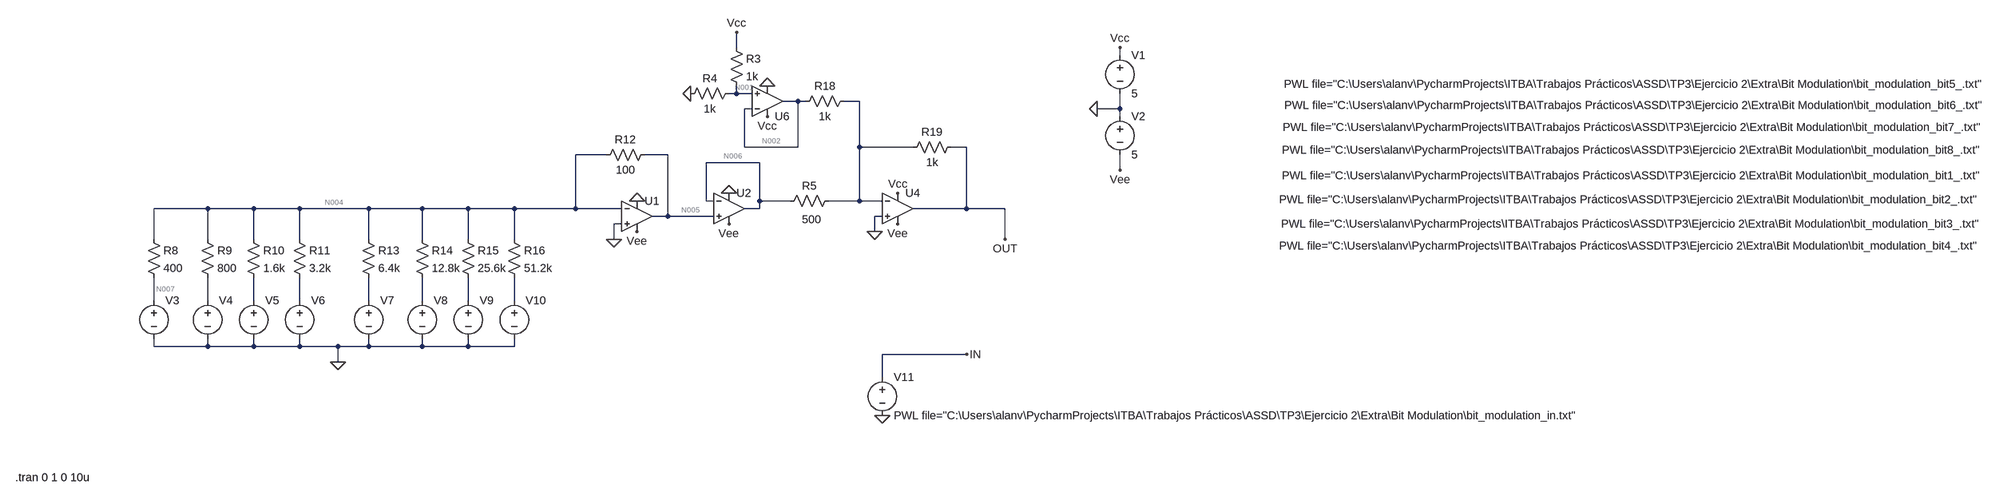
[diagram p0: schematic Bit_Modulation.asc]
Bit_Modulation.asc, the LTspice schematic file:
Version 4
SHEET 1 3244 760
WIRE 432 -160 432 -192
WIRE 1232 -144 1232 -160
WIRE 432 -64 432 -80
WIRE 432 -64 416 -64
WIRE 464 -64 432 -64
WIRE 560 -48 528 -48
WIRE 576 -48 560 -48
WIRE 688 -48 656 -48
WIRE 464 -32 448 -32
WIRE 1232 -32 1232 -64
WIRE 1232 -32 1184 -32
WIRE 1232 -16 1232 -32
WIRE 448 48 448 -32
WIRE 560 48 560 -48
WIRE 560 48 448 48
WIRE 688 48 688 -48
WIRE 800 48 688 48
WIRE 912 48 880 48
WIRE 160 64 96 64
WIRE 288 64 240 64
WIRE 480 80 368 80
WIRE 1232 96 1232 64
WIRE 368 160 368 80
WIRE 384 160 368 160
WIRE 480 160 480 80
WIRE 544 160 480 160
WIRE 688 160 688 48
WIRE 688 160 624 160
WIRE 736 160 688 160
WIRE -672 176 -784 176
WIRE -576 176 -672 176
WIRE -480 176 -576 176
WIRE -336 176 -480 176
WIRE -224 176 -336 176
WIRE -128 176 -224 176
WIRE -32 176 -128 176
WIRE 96 176 96 64
WIRE 96 176 -32 176
WIRE 192 176 96 176
WIRE 480 176 480 160
WIRE 480 176 448 176
WIRE 912 176 912 48
WIRE 912 176 800 176
WIRE 992 176 912 176
WIRE 288 192 288 64
WIRE 288 192 256 192
WIRE 384 192 288 192
WIRE 736 192 720 192
WIRE 192 208 176 208
WIRE 720 224 720 192
WIRE -784 240 -784 176
WIRE -672 240 -672 176
WIRE -576 240 -576 176
WIRE -480 240 -480 176
WIRE -336 240 -336 176
WIRE -224 240 -224 176
WIRE -128 240 -128 176
WIRE -32 240 -32 176
WIRE 176 240 176 208
WIRE 992 240 992 176
WIRE -784 368 -784 320
WIRE -672 368 -672 320
WIRE -576 368 -576 320
WIRE -480 368 -480 320
WIRE -336 368 -336 320
WIRE -224 368 -224 320
WIRE -128 368 -128 320
WIRE -32 368 -32 320
WIRE -784 464 -784 448
WIRE -672 464 -672 448
WIRE -672 464 -784 464
WIRE -576 464 -576 448
WIRE -576 464 -672 464
WIRE -480 464 -480 448
WIRE -480 464 -576 464
WIRE -400 464 -480 464
WIRE -336 464 -336 448
WIRE -336 464 -400 464
WIRE -224 464 -224 448
WIRE -224 464 -336 464
WIRE -128 464 -128 448
WIRE -128 464 -224 464
WIRE -32 464 -32 448
WIRE -32 464 -128 464
WIRE 912 480 736 480
WIRE -400 496 -400 464
WIRE 736 528 736 480
FLAG 1184 -32 0
FLAG 1232 -160 Vcc
FLAG 1232 96 Vee
FLAG 224 224 Vee
FLAG 768 144 Vcc
FLAG 768 208 Vee
FLAG 176 240 0
FLAG 336 -64 0
FLAG 432 -192 Vcc
FLAG 992 240 OUT
FLAG 496 -16 Vcc
FLAG 736 608 0
FLAG 912 480 IN
FLAG 720 224 0
FLAG 416 208 Vee
FLAG 224 160 0
FLAG 416 144 0
FLAG 496 -80 0
FLAG -400 496 0
SYMBOL OpAmps\\UniversalOpamp2 224 192 R0
SYMATTR InstName U1
SYMBOL voltage 1232 -160 R0
WINDOW 123 0 0 Left 0
WINDOW 39 0 0 Left 0
SYMATTR InstName V1
SYMATTR Value 5
SYMBOL voltage 1232 -32 R0
WINDOW 123 0 0 Left 0
WINDOW 39 0 0 Left 0
SYMATTR InstName V2
SYMATTR Value 5
SYMBOL OpAmps\\UniversalOpamp2 768 176 R0
SYMATTR InstName U4
SYMBOL res 416 -176 R0
SYMATTR InstName R3
SYMATTR Value 1k
SYMBOL res 432 -80 R90
WINDOW 0 0 56 VBottom 2
WINDOW 3 32 56 VTop 2
SYMATTR InstName R4
SYMATTR Value 1k
SYMBOL res 640 144 R90
WINDOW 0 0 56 VBottom 2
WINDOW 3 39 51 VTop 2
SYMATTR InstName R5
SYMATTR Value 500
SYMBOL res -800 224 R0
SYMATTR InstName R8
SYMATTR Value 400
SYMBOL res -688 224 R0
SYMATTR InstName R9
SYMATTR Value 800
SYMBOL res -592 224 R0
SYMATTR InstName R10
SYMATTR Value 1.6k
SYMBOL res -496 224 R0
SYMATTR InstName R11
SYMATTR Value 3.2k
SYMBOL voltage -784 352 R0
WINDOW 3 2354 -245 Left 2
WINDOW 123 0 0 Left 0
WINDOW 39 0 0 Left 0
SYMATTR Value PWL file="C:\Users\alanv\PycharmProjects\ITBA\Trabajos Prácticos\ASSD\TP3\Ejercicio 2\Extra\Bit Modulation\bit_modulation_bit1_.txt"
SYMATTR InstName V3
SYMBOL voltage -672 352 R0
WINDOW 3 2236 -195 Left 2
WINDOW 123 0 0 Left 0
WINDOW 39 0 0 Left 0
SYMATTR Value PWL file="C:\Users\alanv\PycharmProjects\ITBA\Trabajos Prácticos\ASSD\TP3\Ejercicio 2\Extra\Bit Modulation\bit_modulation_bit2_.txt"
SYMATTR InstName V4
SYMBOL voltage -576 352 R0
WINDOW 3 2144 -144 Left 2
WINDOW 123 0 0 Left 0
WINDOW 39 0 0 Left 0
SYMATTR Value PWL file="C:\Users\alanv\PycharmProjects\ITBA\Trabajos Prácticos\ASSD\TP3\Ejercicio 2\Extra\Bit Modulation\bit_modulation_bit3_.txt"
SYMATTR InstName V5
SYMBOL voltage -480 352 R0
WINDOW 3 2044 -98 Left 2
WINDOW 123 0 0 Left 0
WINDOW 39 0 0 Left 0
SYMATTR Value PWL file="C:\Users\alanv\PycharmProjects\ITBA\Trabajos Prácticos\ASSD\TP3\Ejercicio 2\Extra\Bit Modulation\bit_modulation_bit4_.txt"
SYMATTR InstName V6
SYMBOL res 256 48 R90
WINDOW 0 0 56 VBottom 2
WINDOW 3 32 56 VTop 2
SYMATTR InstName R12
SYMATTR Value 100
SYMBOL res -352 224 R0
SYMATTR InstName R13
SYMATTR Value 6.4k
SYMBOL res -240 224 R0
SYMATTR InstName R14
SYMATTR Value 12.8k
SYMBOL res -144 224 R0
SYMATTR InstName R15
SYMATTR Value 25.6k
SYMBOL res -48 224 R0
SYMATTR InstName R16
SYMATTR Value 51.2k
SYMBOL voltage -336 352 R0
WINDOW 3 1910 -436 Left 2
WINDOW 123 0 0 Left 0
WINDOW 39 0 0 Left 0
SYMATTR Value PWL file="C:\Users\alanv\PycharmProjects\ITBA\Trabajos Prácticos\ASSD\TP3\Ejercicio 2\Extra\Bit Modulation\bit_modulation_bit5_.txt"
SYMATTR InstName V7
SYMBOL voltage -224 352 R0
WINDOW 3 1799 -392 Left 2
WINDOW 123 0 0 Left 0
WINDOW 39 0 0 Left 0
SYMATTR Value PWL file="C:\Users\alanv\PycharmProjects\ITBA\Trabajos Prácticos\ASSD\TP3\Ejercicio 2\Extra\Bit Modulation\bit_modulation_bit6_.txt"
SYMATTR InstName V8
SYMBOL voltage -128 352 R0
WINDOW 3 1700 -346 Left 2
WINDOW 123 0 0 Left 0
WINDOW 39 0 0 Left 0
SYMATTR Value PWL file="C:\Users\alanv\PycharmProjects\ITBA\Trabajos Prácticos\ASSD\TP3\Ejercicio 2\Extra\Bit Modulation\bit_modulation_bit7_.txt"
SYMATTR InstName V9
SYMBOL voltage -32 352 R0
WINDOW 3 1602 -298 Left 2
WINDOW 123 0 0 Left 0
WINDOW 39 0 0 Left 0
SYMATTR Value PWL file="C:\Users\alanv\PycharmProjects\ITBA\Trabajos Prácticos\ASSD\TP3\Ejercicio 2\Extra\Bit Modulation\bit_modulation_bit8_.txt"
SYMATTR InstName V10
SYMBOL res 560 -32 R270
WINDOW 0 32 56 VTop 2
WINDOW 3 0 56 VBottom 2
SYMATTR InstName R18
SYMATTR Value 1k
SYMBOL res 896 32 R90
WINDOW 0 0 56 VBottom 2
WINDOW 3 32 56 VTop 2
SYMATTR InstName R19
SYMATTR Value 1k
SYMBOL OpAmps\\UniversalOpamp2 496 -48 M180
SYMATTR InstName U6
SYMBOL voltage 736 512 R0
WINDOW 123 0 0 Left 0
WINDOW 39 0 0 Left 0
SYMATTR InstName V11
SYMATTR Value PWL file="C:\Users\alanv\PycharmProjects\ITBA\Trabajos Prácticos\ASSD\TP3\Ejercicio 2\Extra\Bit Modulation\bit_modulation_in.txt"
SYMBOL OpAmps\\UniversalOpamp2 416 176 R0
SYMATTR InstName U2
TEXT -1120 744 Left 2 !.tran 0 1 0 10u

The netlist it stands for:
* Bit_Modulation.asc
XU1 0 N004 0 Vee N005 level.2 Avol=1Meg GBW=10Meg Slew=10Meg ilimit=25m rail=0 Vos=0 phimargin=45 en=0 enk=0 in=0 ink=0 Rin=500Meg  ; pins IN+ IN- V+ V- OUT
V1 Vcc 0 5
V2 0 Vee 5
XU4 0 N003 Vcc Vee OUT level.2 Avol=1Meg GBW=10Meg Slew=10Meg ilimit=25m rail=0 Vos=0 phimargin=45 en=0 enk=0 in=0 ink=0 Rin=500Meg  ; pins IN+ IN- V+ V- OUT
R3 Vcc N001 1k
R4 N001 0 1k
R5 N003 N006 500
R8 N004 N007 400
R9 N004 N008 800
R10 N004 N009 1.6k
R11 N004 N010 3.2k
V3 N007 0 PWL file="C:\Users\alanv\PycharmProjects\ITBA\Trabajos Prácticos\ASSD\TP3\Ejercicio 2\Extra\Bit Modulation\bit_modulation_bit1_.txt"
V4 N008 0 PWL file="C:\Users\alanv\PycharmProjects\ITBA\Trabajos Prácticos\ASSD\TP3\Ejercicio 2\Extra\Bit Modulation\bit_modulation_bit2_.txt"
V5 N009 0 PWL file="C:\Users\alanv\PycharmProjects\ITBA\Trabajos Prácticos\ASSD\TP3\Ejercicio 2\Extra\Bit Modulation\bit_modulation_bit3_.txt"
V6 N010 0 PWL file="C:\Users\alanv\PycharmProjects\ITBA\Trabajos Prácticos\ASSD\TP3\Ejercicio 2\Extra\Bit Modulation\bit_modulation_bit4_.txt"
R12 N005 N004 100
R13 N004 N011 6.4k
R14 N004 N012 12.8k
R15 N004 N013 25.6k
R16 N004 N014 51.2k
V7 N011 0 PWL file="C:\Users\alanv\PycharmProjects\ITBA\Trabajos Prácticos\ASSD\TP3\Ejercicio 2\Extra\Bit Modulation\bit_modulation_bit5_.txt"
V8 N012 0 PWL file="C:\Users\alanv\PycharmProjects\ITBA\Trabajos Prácticos\ASSD\TP3\Ejercicio 2\Extra\Bit Modulation\bit_modulation_bit6_.txt"
V9 N013 0 PWL file="C:\Users\alanv\PycharmProjects\ITBA\Trabajos Prácticos\ASSD\TP3\Ejercicio 2\Extra\Bit Modulation\bit_modulation_bit7_.txt"
V10 N014 0 PWL file="C:\Users\alanv\PycharmProjects\ITBA\Trabajos Prácticos\ASSD\TP3\Ejercicio 2\Extra\Bit Modulation\bit_modulation_bit8_.txt"
R18 N002 N003 1k
R19 OUT N003 1k
XU6 N001 N002 Vcc 0 N002 level.2 Avol=1Meg GBW=10Meg Slew=10Meg ilimit=25m rail=0 Vos=0 phimargin=45 en=0 enk=0 in=0 ink=0 Rin=500Meg  ; pins IN+ IN- V+ V- OUT
V11 IN 0 PWL file="C:\Users\alanv\PycharmProjects\ITBA\Trabajos Prácticos\ASSD\TP3\Ejercicio 2\Extra\Bit Modulation\bit_modulation_in.txt"
XU2 N005 N006 0 Vee N006 level.2 Avol=1Meg GBW=10Meg Slew=10Meg ilimit=25m rail=0 Vos=0 phimargin=45 en=0 enk=0 in=0 ink=0 Rin=500Meg  ; pins IN+ IN- V+ V- OUT
.tran 0 1 0 10u
.lib UniversalOpamps2.sub
.backanno
.end

* Results of the author's LTspice run, read from the files saved beside the schematic
* Operating Point, zero values left out:
*   V(n005) = -1.25 V
*   V(vee) = -5 V
*   V(n004) = -1.143 µV
*   V(vcc) = 5 V
*   V(out) = 4.89 µV
*   V(n001) = 2.5 V
*   V(n006) = -1.25 V
*   V(n007) = 5 V
*   V(n002) = 2.5 V
*   I(R19) = 4.89 nA
*   I(R18) = 2.5 mA
*   I(R16) = -22.32 pA
*   I(R15) = -44.65 pA
*   I(R14) = -89.29 pA
*   I(R13) = -178.6 pA
*   I(R12) = -12.5 mA
*   I(R11) = -357.2 pA
*   I(R10) = -714.3 pA
*   I(R9) = -1.429 nA
*   I(R8) = -12.5 mA
*   I(R5) = 2.5 mA
*   I(R4) = 2.5 mA
*   I(R3) = 2.5 mA
*   I(V10) = -22.32 pA
*   I(V9) = -44.65 pA
*   I(V8) = -89.29 pA
*   I(V7) = -178.6 pA
*   I(V6) = -357.2 pA
*   I(V5) = -714.3 pA
*   I(V4) = -1.429 nA
*   I(V3) = -12.5 mA
*   I(V2) = -15.52 mA
*   I(V1) = -5.525 mA
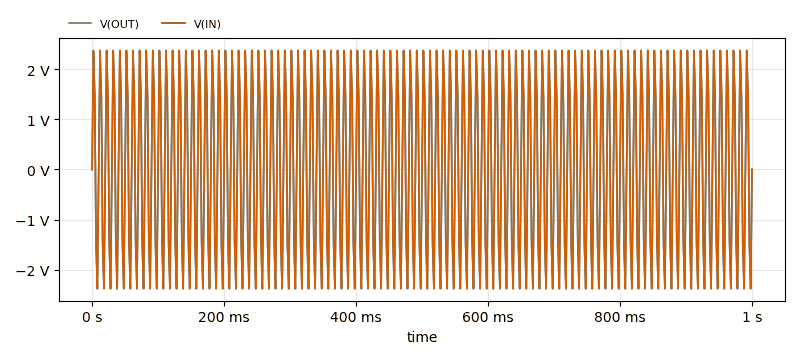
[diagram p1: Transient Analysis of Bit_Modulation.asc, plotted from the saved traces]
* Transient Analysis, 1 run:
*   V(OUT): min -2.383 V, max 2.363 V, average -9.175 mV, rms 1.555 V, last -122.8 µV
*   V(IN): min -2.378 V, max 2.378 V, average 0 V, rms 1.555 V, last 0 V